# Altium schematic sheet adc.SchDoc: 16 Channel ADC
size A4; Revision: 1.0.0; SheetNumber: 3; SheetTotal: 10
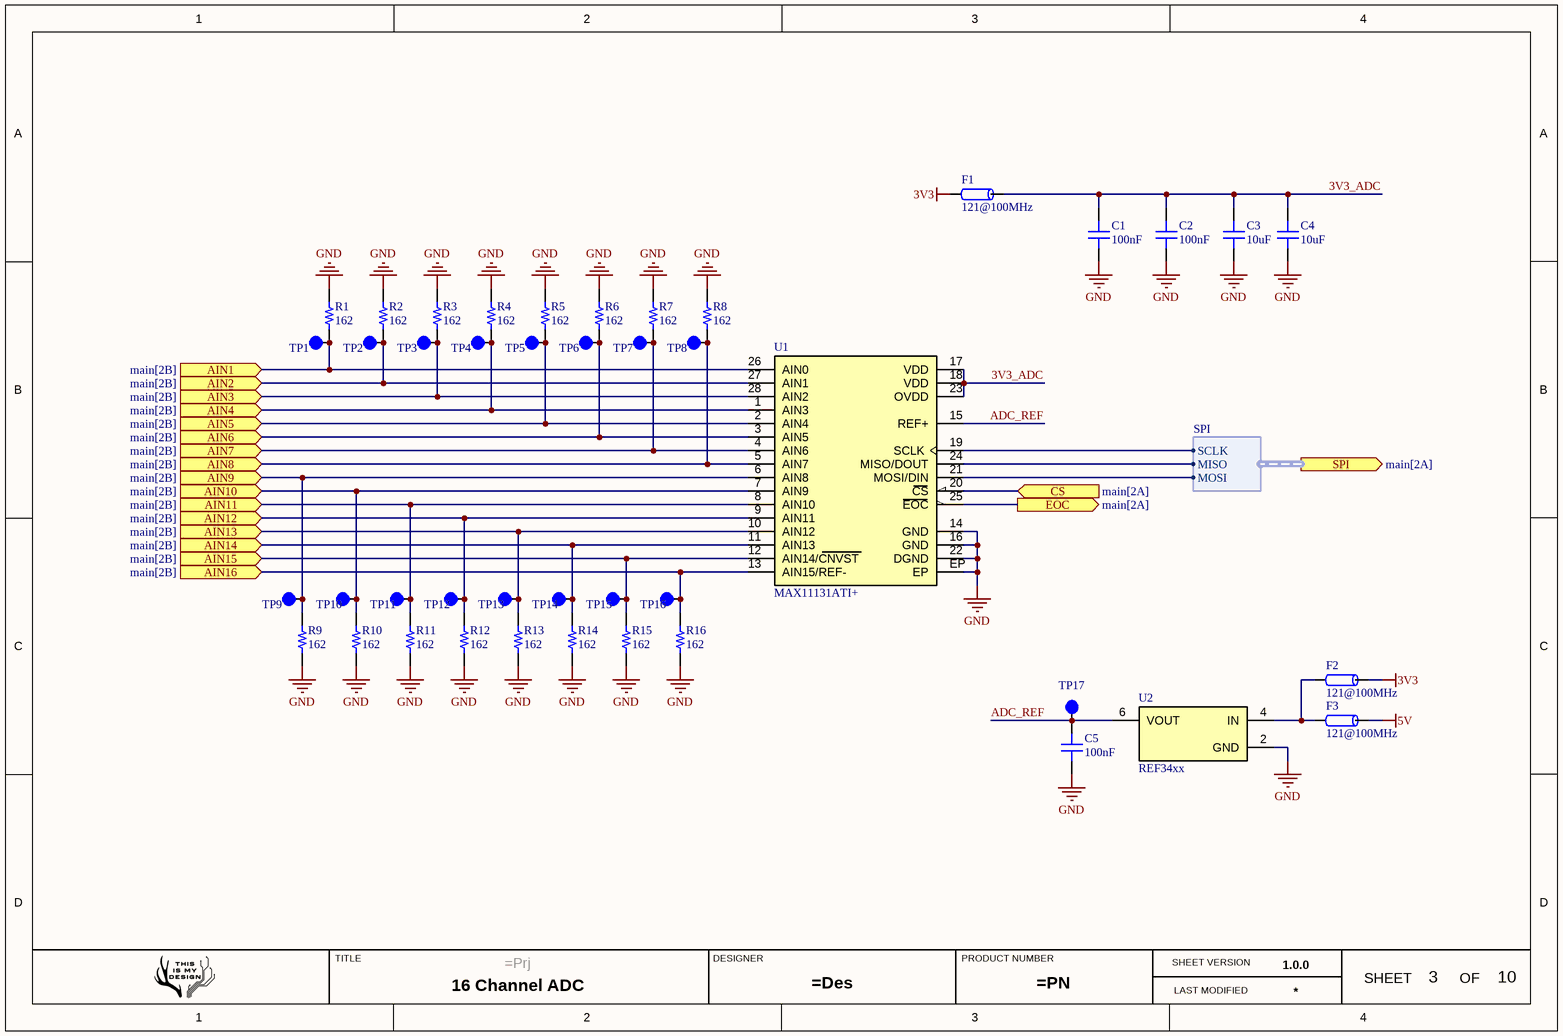
[diagram p0: adc.SchDoc]

## Parts
C1  100nF  [CAP 0603_1608]
C2  100nF  [CAP 0603_1608]
C3  10uF  [CAP 0603_1608]
C4  10uF  [CAP 0603_1608]
C5  100nF  [CAP 0603_1608]
F1  121@100MHz  [Ferrite-0805]
F2  121@100MHz  [Ferrite-0805]
F3  121@100MHz  [Ferrite-0805]
R1  162  [RES 0402_1005]
R2  162  [RES 0402_1005]
R3  162  [RES 0402_1005]
R4  162  [RES 0402_1005]
R5  162  [RES 0402_1005]
R6  162  [RES 0402_1005]
R7  162  [RES 0402_1005]
R8  162  [RES 0402_1005]
R9  162  [RES 0402_1005]
R10  162  [RES 0402_1005]
R11  162  [RES 0402_1005]
R12  162  [RES 0402_1005]
R13  162  [RES 0402_1005]
R14  162  [RES 0402_1005]
R15  162  [RES 0402_1005]
R16  162  [RES 0402_1005]
TP1  Test Point  [TEST_POINT_0R5]  (value not drawn)  (no BOM)
TP2  Test Point  [TEST_POINT_0R5]  (value not drawn)  (no BOM)
TP3  Test Point  [TEST_POINT_0R5]  (value not drawn)  (no BOM)
TP4  Test Point  [TEST_POINT_0R5]  (value not drawn)  (no BOM)
TP5  Test Point  [TEST_POINT_0R5]  (value not drawn)  (no BOM)
TP6  Test Point  [TEST_POINT_0R5]  (value not drawn)  (no BOM)
TP7  Test Point  [TEST_POINT_0R5]  (value not drawn)  (no BOM)
TP8  Test Point  [TEST_POINT_0R5]  (value not drawn)  (no BOM)
TP9  Test Point  [TEST_POINT_0R5]  (value not drawn)  (no BOM)
TP10  Test Point  [TEST_POINT_0R5]  (value not drawn)  (no BOM)
TP11  Test Point  [TEST_POINT_0R5]  (value not drawn)  (no BOM)
TP12  Test Point  [TEST_POINT_0R5]  (value not drawn)  (no BOM)
TP13  Test Point  [TEST_POINT_0R5]  (value not drawn)  (no BOM)
TP14  Test Point  [TEST_POINT_0R5]  (value not drawn)  (no BOM)
TP15  Test Point  [TEST_POINT_0R5]  (value not drawn)  (no BOM)
TP16  Test Point  [TEST_POINT_0R5]  (value not drawn)  (no BOM)
TP17  Test Point  [TEST_POINT_0R5]  (value not drawn)  (no BOM)
U1  MAX11131ATI+  [TQFN-28]
U2  REF34xx  [SOT23-6L]

## Ports
AIN1 (in, see main[2B]), AIN2 (in, see main[2B]), AIN3 (in, see main[2B]), AIN4 (in, see main[2B]), AIN5 (in, see main[2B]), AIN6 (in, see main[2B]), AIN7 (in, see main[2B]), AIN8 (in, see main[2B]), AIN9 (in, see main[2B]), AIN10 (in, see main[2B]), AIN11 (in, see main[2B]), AIN12 (in, see main[2B]), AIN13 (in, see main[2B]), AIN14 (in, see main[2B]), AIN15 (in, see main[2B]), AIN16 (in, see main[2B]), CS (in, see main[2A]), EOC (out, see main[2A]), SPI (out, harness SPI, see main[2A])

## Harnesses
SPI: SCLK, MISO, MOSI

## Nets
3V3: F1.1 F2.2
5V: F3.2
GND: C1.1 C2.1 C3.1 C4.1 C5.1 R1.2 R2.2 R3.2 R4.2 R5.2 R6.2 R7.2 R8.2 R9.1 R10.1 R11.1 R12.1 R13.1 R14.1 R15.1 R16.1 U1.14(GND) U1.16(GND) U1.22(DGND) U1.EP U2.2(GND)
3V3_ADC: C1.2 C2.2 C3.2 C4.2 F1.2 U1.17(VDD) U1.18(VDD) U1.23(OVDD)
ADC_REF: C5.2 TP17.0 U1.15(REF+) U2.6(VOUT)
AIN1: R1.1 TP1.0 U1.26(AIN0) ; port AIN1
AIN2: R2.1 TP2.0 U1.27(AIN1) ; port AIN2
AIN3: R3.1 TP3.0 U1.28(AIN2) ; port AIN3
AIN4: R4.1 TP4.0 U1.1(AIN3) ; port AIN4
AIN5: R5.1 TP5.0 U1.2(AIN4) ; port AIN5
AIN6: R6.1 TP6.0 U1.3(AIN5) ; port AIN6
AIN7: R7.1 TP7.0 U1.4(AIN6) ; port AIN7
AIN8: R8.1 TP8.0 U1.5(AIN7) ; port AIN8
AIN9: R9.2 TP9.0 U1.6(AIN8) ; port AIN9
AIN10: R10.2 TP10.0 U1.7(AIN9) ; port AIN10
AIN11: R11.2 TP11.0 U1.8(AIN10) ; port AIN11
AIN12: R12.2 TP12.0 U1.9(AIN11) ; port AIN12
AIN13: R13.2 TP13.0 U1.10(AIN12) ; port AIN13
AIN14: R14.2 TP14.0 U1.11(AIN13) ; port AIN14
AIN15: R15.2 TP15.0 U1.12(AIN14/CNVST) ; port AIN15
AIN16: R16.2 TP16.0 U1.13(AIN15/REF-) ; port AIN16
CS: U1.20(CS) ; port CS
EOC: U1.25(EOC) ; port EOC
NetF2_1: F2.1 F3.1 U2.4(IN)
NetU1_19: U1.19(SCLK) ; port SPI.SCLK
NetU1_21: U1.21(MOSI/DIN) ; port SPI.MOSI
NetU1_24: U1.24(MISO/DOUT) ; port SPI.MISO

## Notes on the sheet
- TITLE
- DESIGNER
- PRODUCT NUMBER
- SHEET VERSION
- LAST MODIFIED
- SHEET
- OF

## Library data of the parts
C1-C5 = Cap 0603: SMT Capacitor
  C1 C2 C5: VALUE: 100nF
  C3 C4: VALUE: 10uF
F1-F3 = Ferrite Bead
R1-R16 = Res 0402: SMT Resistor; VALUE: 162
TP1-TP17 = Test Point: PCB Test Point
U1 = MAX11131: Analog to Digital Converters - ADC Pin-/Software-Compatible Family of 10-/12-Bit, 8-/16-Channel, 3Msps ADCs with External Reference
U2 = REF34xx: Voltage References low-drift, low-power